# EAGLE schematic logic-noise-filters-and-drums (EAGLE 7.2.0)
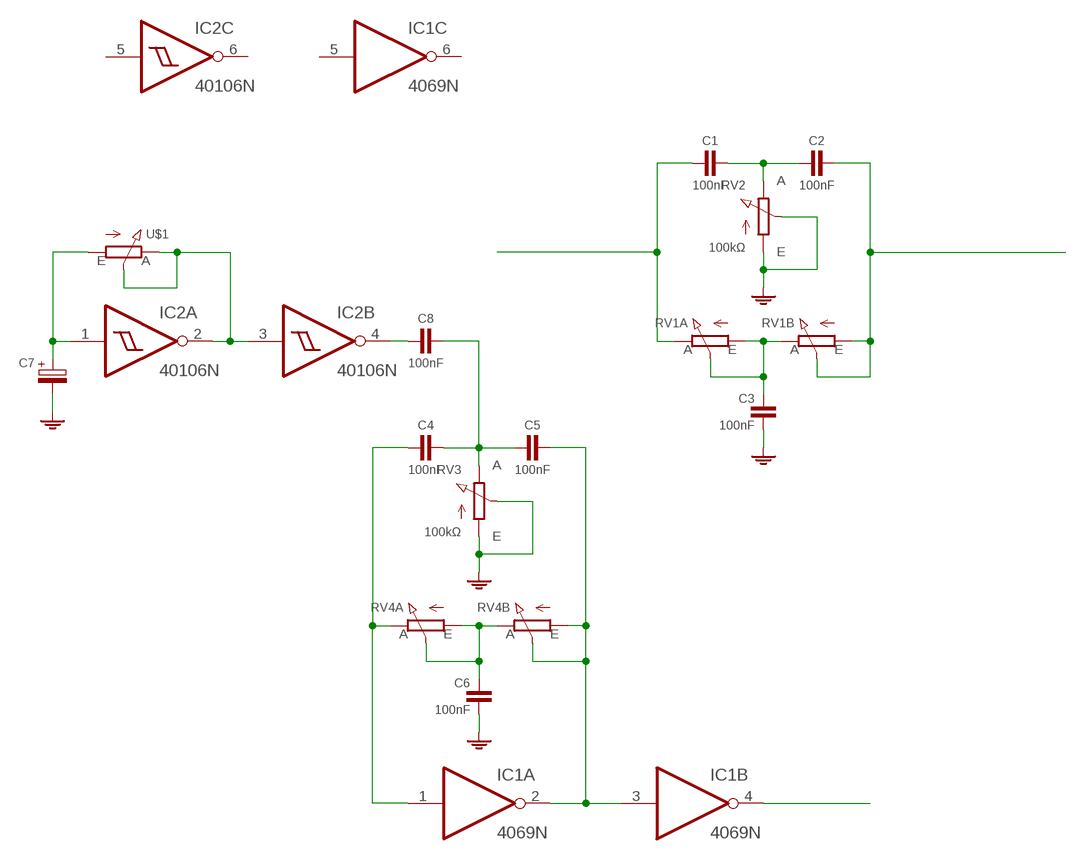
[diagram p0: schematic, sheet 1]

## Parts
C1  100nF  C-H075-020X044  [C075-020X044]
C2  100nF  C-H075-020X044  [C075-020X044]
C3  100nF  C075-020X044  [C075-020X044]
C4  100nF  C-H075-020X044  [C075-020X044]
C5  100nF  C-H075-020X044  [C075-020X044]
C6  100nF  C075-020X044  [C075-020X044]
C7  CPOLE2,5-5/V  [E2,5-5/V]
C8  100nF  C-H075-020X044  [C075-020X044]
IC1  4069N  [DIL14]
IC2  40106N  [DIL14]
RV1  POT-STEREO  [POT-STEREO-2X3]
RV2  100kΩ  POT  [POT]
RV3  100kΩ  POT  [POT]
RV4  POT-STEREO  [POT-STEREO-2X3]
U$1  POT-H  [POT]

## Nets
GND: C3.2 C6.2 C7.- RV2.A RV2.S RV3.A RV3.S
N$1: C7.+ IC2.1(A:I) U$1.A
N$2: C1.2 C2.1 RV2.E
N$3: C3.1 RV1.1-A(A:A) RV1.1-S(A:S) RV1.2-E(B:E)
N$4: C6.1 RV4.1-A(A:A) RV4.1-S(A:S) RV4.2-E(B:E)
N$5: IC2.2(A:O) IC2.3(B:I) U$1.E U$1.S
N$7: C8.1 IC2.4(B:O)
TT1IN: C1.1 RV1.1-E(A:E)
TT1OUT: C2.2 RV1.2-A(B:A) RV1.2-S(B:S)
TT2: IC1.4(B:O)
TT2IN: C4.1 IC1.1(A:I) RV4.1-E(A:E)
TT2OUT: C5.2 IC1.2(A:O) IC1.3(B:I) RV4.2-A(B:A) RV4.2-S(B:S)
TT2TRIG: C4.2 C5.1 C8.2 RV3.E
Unconnected: IC1.5(C:I) IC1.6(C:O) IC1.8(D:O) IC1.9(D:I) IC1.10(E:O) IC1.11(E:I) IC1.12(F:O) IC1.13(F:I) IC2.5(C:I) IC2.6(C:O) IC2.8(D:O) IC2.9(D:I) IC2.10(E:O) IC2.11(E:I) IC2.12(F:O) IC2.13(F:I)

## Power pins joined to a net without a drawn wire
VDD: IC1.14(P:VDD) IC2.14(P:VDD)
VSS: IC1.7(P:VSS) IC2.7(P:VSS)

## Library data of the parts
C1 C2 C4 C5 C8 = c:C-H
C3 C6 = c:C: CAPACITOR, European symbol
C7 = c:CPOL: POLARIZED CAPACITOR, European symbol
IC1 = ic:4069: Hex INVERTER
IC2 = ic:40106: CMOS Logic Devices, 4000 Series Based on the following sources: Motorola CMOS LOGIC DATA; book, 02/88, DL131 REV 1 http://www.elexp.com http://www.intersil.com http://www.ls3c.com.tw/product/1/COMOS.html Created by librarian@cadsoft.de
RV1 RV4 = r:POT-STEREO
RV2 RV3 = r:POT
U$1 = r:POT-H